# Altium schematic sheet ARM2.SchDoc: Animated Archer Main PCB
size Letter; Author: John Eric Martin; Engineer: John Eric Martin; Organization: UCCS IEEE Robotics; Address1: 1420 Austin Bluffs Pkwy; Address2: Colorado Springs, CO 80918; DocumentNumber: ARM2; Revision: 1; SheetNumber: 2; SheetTotal: 10; ProjectName: Animated Archer Quadcopter
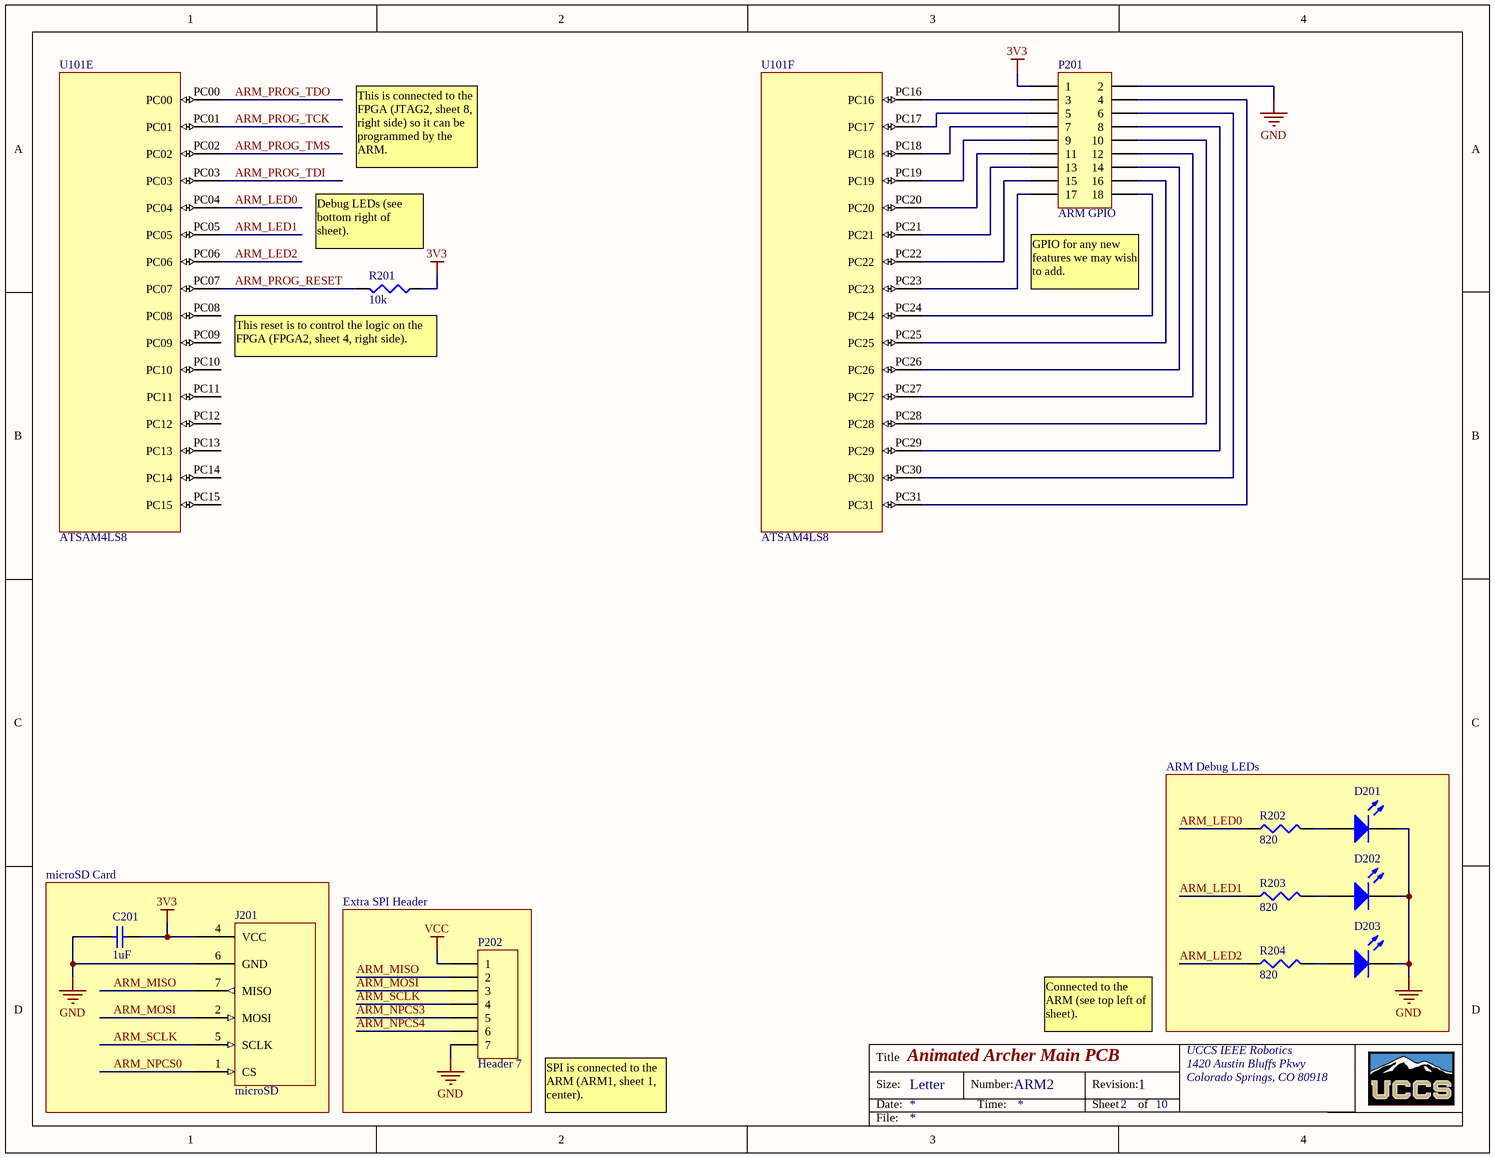
[diagram p0: ARM2.SchDoc]

## Parts
C201  value 1uF  [1608[0603]]  (hidden comment: 0.1uF)
D201  Green  [1608[0603]]  (value not drawn)
D202  Green  [1608[0603]]  (value not drawn)
D203  Green  [1608[0603]]  (value not drawn)
J201  microSD  [500873-0806]
P201  ARM GPIO  [HDR2X9]
P202  Header 7  [HDR1X7]
R201  value 10k  [J1-0603]  (hidden comment: Res3)
R202  value 820  [J1-0603]  (hidden comment: Res3)
R203  value 820  [J1-0603]  (hidden comment: Res3)
R204  value 820  [J1-0603]  (hidden comment: Res3)
U101  ATSAM4LS8  [LQFP100_N]  (parts E,F of 6)

## Blocks framed on the sheet
ARM Debug LEDs: D201-D203 R202-R204
microSD Card: C201 J201
Extra SPI Header: P202

## Nets
3V3: C201.1 J201.4(VCC) P201.1 R201.1
GND: C201.2 D201.2(K) D202.2(K) D203.2(K) J201.6(GND) P201.2 P202.7
VCC: P202.1
ARM_LED0: R202.1 U101.PC04
ARM_LED1: R203.1 U101.PC05
ARM_LED2: R204.1 U101.PC06
ARM_MISO: J201.7(MISO) P202.2
ARM_MOSI: J201.2(MOSI) P202.3
ARM_NPCS0: J201.1(CS)
ARM_NPCS3: P202.5
ARM_NPCS4: P202.6
ARM_PROG_RESET: R201.2 U101.PC07
ARM_PROG_TCK: U101.PC01
ARM_PROG_TDI: U101.PC03
ARM_PROG_TDO: U101.PC00
ARM_PROG_TMS: U101.PC02
ARM_SCLK: J201.5(SCLK) P202.4
NetD201_1: D201.1(A) R202.2
NetD202_1: D202.1(A) R203.2
NetD203_1: D203.1(A) R204.2
NetP201_3: P201.3 U101.PC16
NetP201_4: P201.4 U101.PC31
NetP201_5: P201.5 U101.PC17
NetP201_6: P201.6 U101.PC30
NetP201_7: P201.7 U101.PC18
NetP201_8: P201.8 U101.PC29
NetP201_9: P201.9 U101.PC19
NetP201_10: P201.10 U101.PC28
NetP201_11: P201.11 U101.PC20
NetP201_12: P201.12 U101.PC27
NetP201_13: P201.13 U101.PC21
NetP201_14: P201.14 U101.PC26
NetP201_15: P201.15 U101.PC22
NetP201_16: P201.16 U101.PC25
NetP201_17: P201.17 U101.PC23
NetP201_18: P201.18 U101.PC24

Not connected (* = marked no-connect by the designer): U101 PC08 PC09 PC10 PC11 PC12 PC13 PC14 PC15

## Notes on the sheet
- This is connected to the FPGA (JTAG2, sheet 8, right side) so it can be programmed by the ARM.
- (near R201) Debug LEDs (see bottom right of sheet).
- (near P201) GPIO for any new features we may wish to add.
- (near R201) This reset is to control the logic on the FPGA (FPGA2, sheet 4, right side).
- Connected to the ARM (see top left of sheet).
- SPI is connected to the ARM (ARM1, sheet 1, center).
- Title
- Size:
- Date:
- Letter
- Number:
- Time:
- Revision:
- Sheet
- of
- File:

## Library data of the parts
C201 = Cap Semi: Capacitor (Semiconductor SIM Model); Published: 8-Jun-2000; LatestRevisionDate: 29-May-2009; LatestRevisionNote: IPC-7351 Footprint Added.; PackageReference: C1206; Publisher: Altium Limited; PackageDescription: Chip Capacitor
D201-D203 = LED2: Typical RED, GREEN, YELLOW, AMBER GaAs LED; Published: 8-Jun-2000; LatestRevisionDate: 17-Jul-2002; LatestRevisionNote: Re-released for DXP Platform.; PackageVersion: Feb-2002; PackageReference: 3.2X1.6X1.1; Publisher: Altium Limited; PackageDescription: SM LED; 2 Flat Leads
J201 = 500873-0806: microSD Memory Card Connector
P201 = Header 9X2: Header, 9-Pin, Dual row; LatestRevisionDate: 17-Jul-2002; LatestRevisionNote: Re-released for DXP Platform.; Publisher: Altium Limited
P202 = Header 7: Header, 7-Pin; LatestRevisionDate: 17-Jul-2002; LatestRevisionNote: Re-released for DXP Platform.; Publisher: Altium Limited
R201-R204 = Res3: Resistor; Published: 8-Jun-2000; LatestRevisionDate: 29-May-2009; LatestRevisionNote: IPC-7351 Footprint Added.; PackageReference: J1-0603; Publisher: Altium Limited; PackageDescription: Chip Resistor
U101 = ATSAM4LS8: Atmel SAM4L ARM Cortex-M4 MCU (ATSAM4LS8CA-CFU); Supplier 1: Mouser; Supplier 2: Newark; Supplier 3: Digi-Key; Supplier 4: Digi-Key; Supplier 5: Digi-Key; Supplier 6: Digi-Key; Supplier Part Number 1: 556-ATSAM4LS8CA-CFU; Supplier Part Number 2: 23X6451; Supplier Part Number 3: ATSAM4LS8CA-CFU-ND; Supplier Part Number 4: ATSAM4LS8CA-CFURTR-ND; Supplier Part Number 5: ATSAM4LS8CA-CFURCT-ND; Supplier Part Number 6: ATSAM4LS8CA-CFURDKR-ND